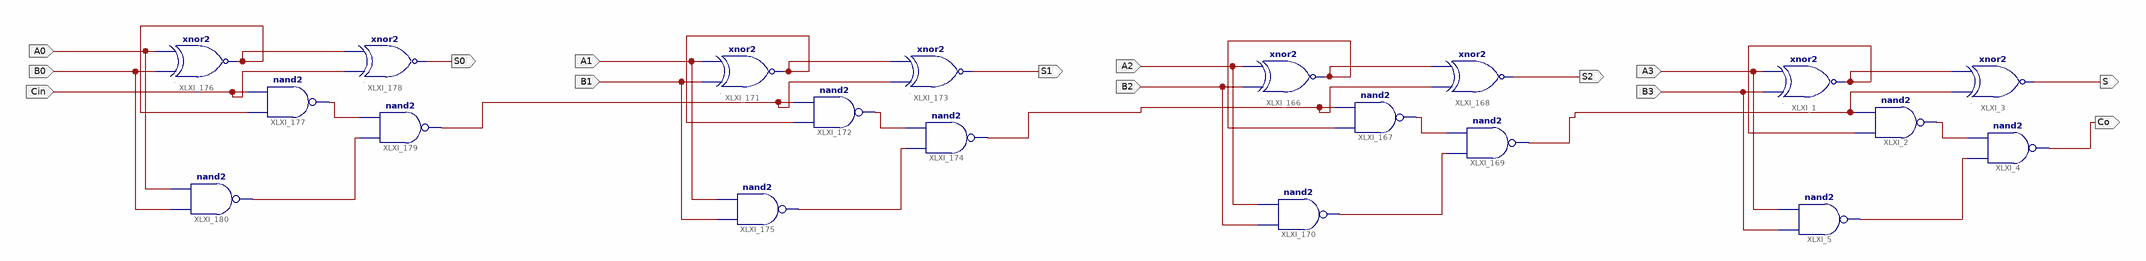
[diagram p0: schematic sheet 1]
// Xilinx ISE schematic lab7_sch1.sch (xa9500xl) as structural Verilog: 20 symbols, 14 ports
module lab7_sch1 (
  input  A3,
  input  B3,
  input  A2,
  input  B2,
  input  A1,
  input  B1,
  input  A0,
  input  B0,
  input  Cin,
  output S,
  output Co,
  output S2,
  output S1,
  output S0
);

  wire XLXN_4, XLXN_9, XLXN_10, XLXN_378, XLXN_383, XLXN_384, XLXN_389, XLXN_392, XLXN_394, XLXN_395,
       XLXN_400, XLXN_403, XLXN_405, XLXN_406, XLXN_407;

  xnor XLXI_1 (XLXN_4, B3, A3);
  nand XLXI_2 (XLXN_10, XLXN_4, XLXN_407);
  xnor XLXI_3 (S, XLXN_407, XLXN_4);
  nand XLXI_4 (Co, XLXN_9, XLXN_10);
  nand XLXI_5 (XLXN_9, B3, A3);
  xnor XLXI_166 (XLXN_378, B2, A2);
  nand XLXI_167 (XLXN_384, XLXN_378, XLXN_392);
  xnor XLXI_168 (S2, XLXN_392, XLXN_378);
  nand XLXI_169 (XLXN_407, XLXN_383, XLXN_384);
  nand XLXI_170 (XLXN_383, B2, A2);
  xnor XLXI_171 (XLXN_389, B1, A1);
  nand XLXI_172 (XLXN_395, XLXN_389, XLXN_403);
  xnor XLXI_173 (S1, XLXN_403, XLXN_389);
  nand XLXI_174 (XLXN_392, XLXN_394, XLXN_395);
  nand XLXI_175 (XLXN_394, B1, A1);
  xnor XLXI_176 (XLXN_400, B0, A0);
  nand XLXI_177 (XLXN_406, XLXN_400, Cin);
  xnor XLXI_178 (S0, Cin, XLXN_400);
  nand XLXI_179 (XLXN_403, XLXN_405, XLXN_406);
  nand XLXI_180 (XLXN_405, B0, A0);
endmodule
